# Altium schematic sheet WheelMotor.SchDoc
size A4
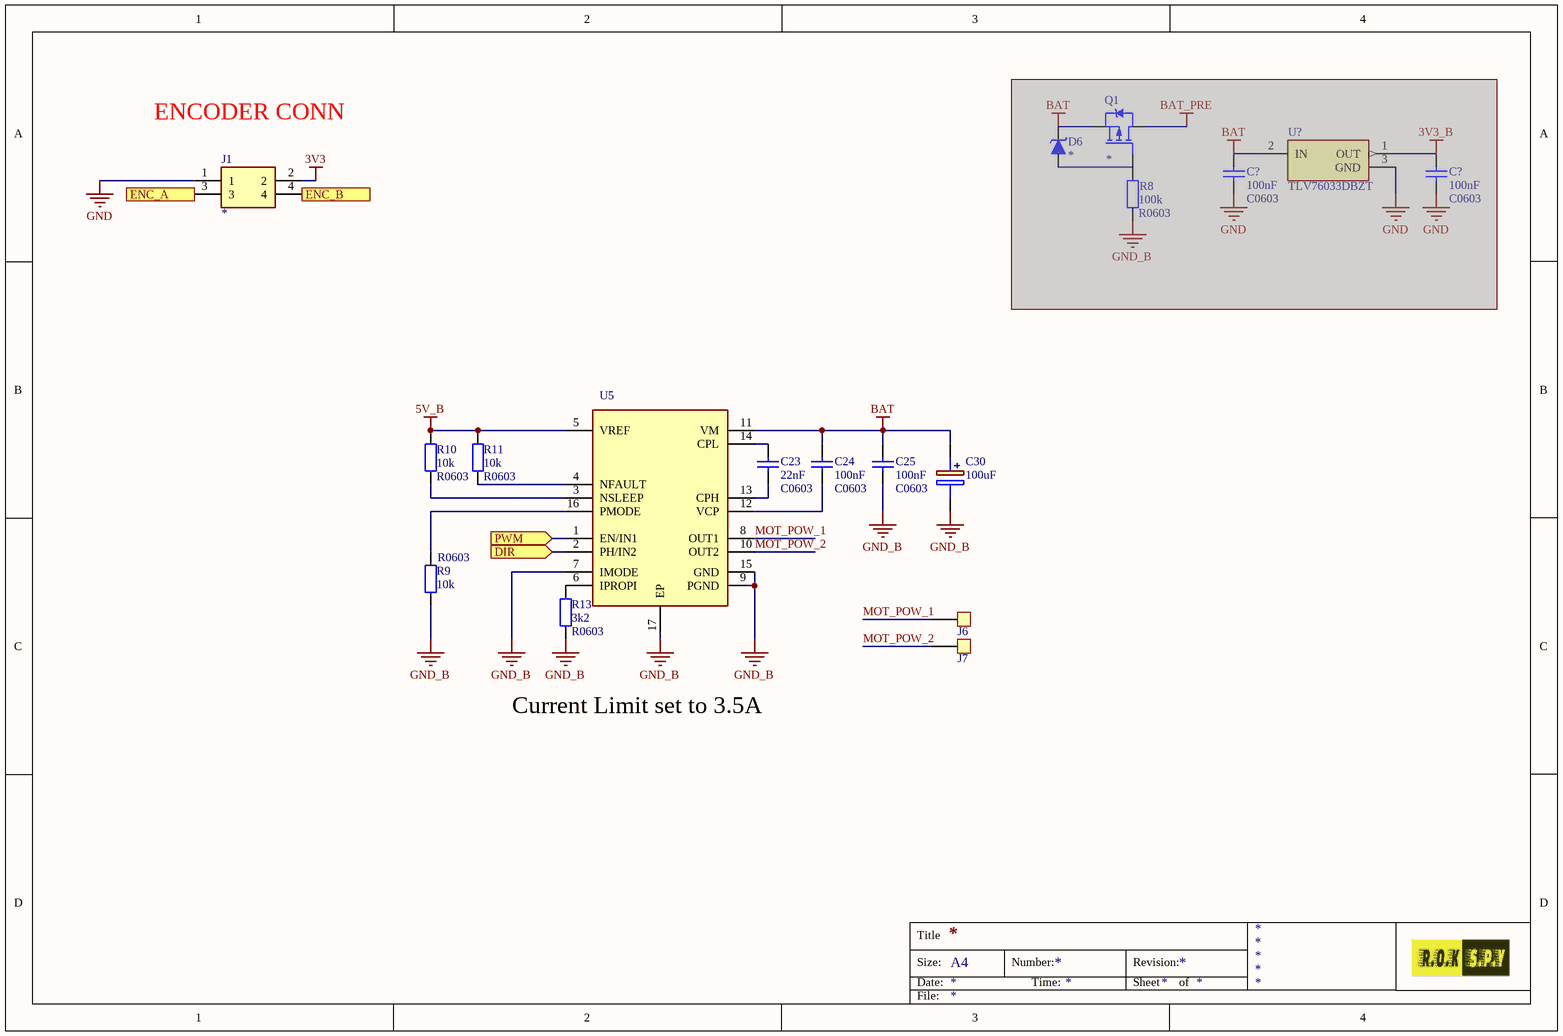
[diagram p0: WheelMotor.SchDoc]

## Parts
(Parts that share a designator on the sheet are numbered #1, #2 ... from top to bottom, then left to right.)
C23  Capacitance: 22nF  [C0603]
C24  Capacitance: 100nF  [C0603]
C25  Capacitance: 100nF  [C0603]
C30  100uF  [CAPPRD250W55D630H1220]
C?#1  Capacitance: 100nF  [C0603]  (masked out: inside a compile mask, not in the netlist)
C?#2  Capacitance: 100nF  [C0603]  (masked out: inside a compile mask, not in the netlist)
D6  *  (masked out: inside a compile mask, not in the netlist)
J1  215079-4  [TE_215079-4]  (value not drawn)
J6  Connection_pad  [Wire_Pad]  (value not drawn)
J7  Connection_pad  [Wire_Pad]  (value not drawn)
Q1  *  (masked out: inside a compile mask, not in the netlist)
R8  100k  [R0603]  (masked out: inside a compile mask, not in the netlist)
R9  10k  [R0603]
R10  10k  [R0603]
R11  10k  [R0603]
R13  3k2  [R0603]
U5  DRV8874PWPR  [SOP65P640X120-17N]  (value not drawn)
U?  TLV76033DBZT  [SOT23]  (masked out: inside a compile mask, not in the netlist)

## Ports
DIR (in), ENC_A (out), ENC_B (out), PWM (in)

## Nets
3V3: J1.2
5V_B: R10.2 R11.2 U5.5(VREF)
BAT: C24.2 C25.2 C30.1(+) U5.11(VM)
GND: J1.1
GND_B: C25.1 C30.2(-) R9.1 R13.1 U5.7(IMODE) U5.9(PGND) U5.15(GND) U5.17(EP)
DIR: U5.2(PH/IN2) ; port DIR
ENC_A: J1.3 ; port ENC_A
ENC_B: J1.4 ; port ENC_B
MOT_POW_1: J6.1 U5.8(OUT1)
MOT_POW_2: J7.1 U5.10(OUT2)
PWM: U5.1(EN/IN1) ; port PWM
NetC23_1: C23.1 U5.13(CPH)
NetC23_2: C23.2 U5.14(CPL)
NetC24_1: C24.1 U5.12(VCP)
NetR9_2: R9.2 U5.16(PMODE)
NetR10_1: R10.1 U5.3(NSLEEP)
NetR11_1: R11.1 U5.4(NFAULT)
NetR13_2: R13.2 U5.6(IPROPI)

## Notes on the sheet
- ENCODER CONN
- Current Limit set to 3.5A
- Title
- Size:
- Date:
- A4
- Number:
- Time:
- Revision:
- Sheet
- of
- File:

## Library data of the parts
C23-C25 C?#1 C?#2 = Capacitor: Ceramic capacitor; Type: MLCC; Voltage rating: *V; ComponentLinknDescription: Datasheet; Characteristic: *; Manufacturer: *; ComponentLinknURL: *; Note: C0603
C30 = EEUFC1E101S: Capacitor Polarised; Datasheet Link: *; Height: *; Manufacturer_Name: *; Manufacturer_Part_Number: *; Capacitance: 100uF; Voltage Rating: *; Farnell Order Nr: *
D6 = Zenner Diode: PartNumber: *; Parameter 2: *; Parameter 3: *; Parameter 4: *; Farnell Order Nr: *; Zenner Voltage: *
J1 = 215079-4: 4 Position Receptacle Connector Through Hole; MF: TE Connectivity; Price: None; Availability: Unavailable; SnapEDA_Link: https://www.snapeda.com/parts/215079-4/TE%20Connectivity%20AMP%20Connectors/view-part/2366486/?ref=snap; EU_RoHS_Compliance: Compliant; Value: *; MP: 215079-4; TE_purchase_URL: https://www.te.com/usa-en/product-215079-4.html?te_bu=Cor&te_type=disp&te_campaign=seda_glo_cor-seda-global-disp-prtnr-fy19-seda-model-bom-cta_sma-317_1&elqCampaignId=32493; Package: SMD-6 Omron Electronics; Comment_1: *
Q1 = P-Channel MOSFET: PartNumber: *; GS breakdown Volt: *; Farnell Order Nr: *; DS Breakdown Volt: *; Drain Current: *; rDSon: *; Parameter 2: *; Parameter 3: *; Datasheet: *
R8-R11 R13 = Resistor: Precision: *%; Voltage rating: *V; Temp coefficient: *ppm; Power rating: *mW; ComponentLinknDescription: Datasheet; Manufacturer: *; ComponentLinknURL: *; Note: R0603
  R8: Resistance: 100k
  R9-R11: Resistance: 10k
  R13: Resistance: 3k2
U5 = DRV8874PWPR: DRV8874H-BridgeMotorDriverWith IntegratedCurrentSenseand Regulation; Manufacturer_Name: Texas Instruments; Datasheet Link: https://www.ti.com/lit/gpn/DRV8874; Height: 1.2mm; Manufacturer_Part_Number: DRV8874PWPR; ComponentLink1Description: Datasheet; ComponentLink1URL: https://www.ti.com/lit/gpn/DRV8874
U? = TLV760: 100-mA,30-V, Fixed-Output,Linear-VoltageRegulator; Manufacturer_Name: Texas Instruments; Datasheet Link: http://www.ti.com/lit/ds/symlink/tlv760.pdf; Height: 0.95mm; Manufacturer_Part_Number: TLV76033DBZT; PartNumber: TLV76033DBZT; Farnell Order Nr: 3007803; ComponentLink1Description: Datasheet; ComponentLink1URL: https://www.ti.com/lit/ds/symlink/tlv760.pdf?HQS=TI-null-null-mousermode-df-pf-null-wwe&DCM=yes&ref_url=https%3A%2F%2Feu.mouser.com%2F&distId=26